# Altium project UVM AERO BSPD.PrjPcb (part 2 of 2)
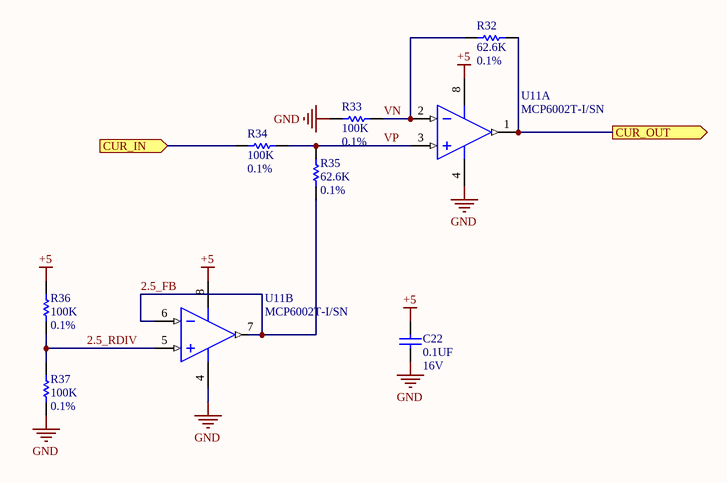
[diagram p7: Current Scaler.SchDoc]

## Nets that join several sheets
+5: Comparator (17 pins), LatchDelay (13 pins), Power Supply (5 pins), Relay (D6.1 K1.5), IO and Connectors (C20.2 C21.2 U9.5 U10.5), Current Scaler (C22.2 R36.2 U11.8)
+5_EXT: Power Supply (L2.3), IO and Connectors (J2.7)
+15: Power Supply (PS1.11 PS1.14), IO and Connectors (J3.1)
-5: Comparator (5 pins), Power Supply (C5.1 C6.1 C7.1 L3.2)
-15: Power Supply (PS1.2 PS1.23), IO and Connectors (J3.2)
CHASS: Power Supply (NT1.2), IO and Connectors (J4.1 R31.1)
GND: Comparator (16 pins), LatchDelay (16 pins), Power Supply (20 pins), Relay (D7.C Q1.2), IO and Connectors (8 pins), Current Scaler (C22.1 R33.1 R37.1 U11.4)
GND_EXT: Power Supply (L2.2), IO and Connectors (J2.8)
BRAKE_IN: Comparator (TP1.1 U1.3), IO and Connectors (D9.2 J2.6 U9.3)
BSPD_FLT: Comparator (R11.2 U3.18 U3.19), LatchDelay (R24.1 U8.1)
BSPD_OK: LatchDelay (U6.3), Relay (R29.1 R30.1)
CUR_IN: Comparator (SW1.3 TP3.1), IO and Connectors (D8.2 D8.3 D8.4 J3.3), Current Scaler (R34.1)
CUR_OUT: IO and Connectors (D9.4 J2.5), Current Scaler (R32.1 U11.1)
FAULT_DET: LatchDelay (U6.5), IO and Connectors (U10.2)
IN+: Power Supply (F2.1), IO and Connectors (J2.2)
IN-: Power Supply (D2.2 L4.2 NT1.1), IO and Connectors (J2.3)
OOR_FLT: Comparator (U4.4), LatchDelay (R19.1 U5.1)
SHDN_IN: Relay (K1.1), IO and Connectors (J1.2)
SHDN_OUT: Relay (K1.3), IO and Connectors (J1.1)

## Assembly variants
needtoorder: not fitted PS1
minimal: not fitted C3 C4 C6 C7 C9 PS1 R5 R10 R15
Built: all parts fitted